# Altium project BGA_Demo_Project.PrjPcb
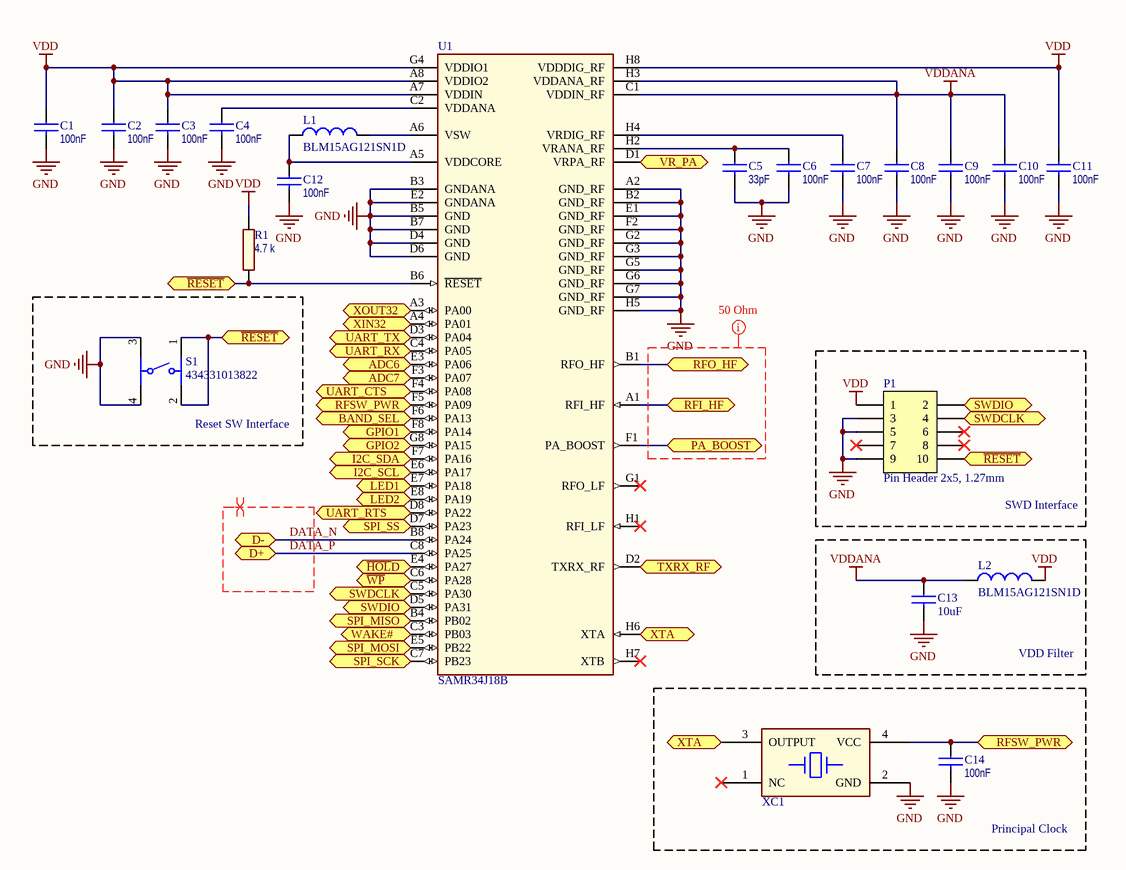
[diagram p0: BGA_Demo_Sch.SchDoc]
1 sheet, 21 parts. Net scope: flat (ports and power ports of the same name join across sheets).
Board file: PCB_BGA_Demo.PcbDoc

## Sheet BGA_Demo_Sch.SchDoc: BGA Demo Project
size A4; Author: Jorge de Castro; CompanyName: PCB Zero; DrawnBy: Jorge de Castro; Engineer: Jorge de Castro; Organization: PCB Zero; Address1: Universo 3; Address2: Valladolid; Address3: 47011; Address4: Spain; DocumentNumber: 1; Revision: 1; SheetNumber: 1; SheetTotal: 1

### Parts
C1  value 100nF  [AP1-00032]  (hidden comment: CAP-NONPOL)
C2  value 100nF  [AP1-00032]  (hidden comment: CAP-NONPOL)
C3  value 100nF  [AP1-00032]  (hidden comment: CAP-NONPOL)
C4  value 100nF  [AP1-00032]  (hidden comment: CAP-NONPOL)
C5  value 33pF  [AP1-00032]  (hidden comment: CAP-NONPOL)
C6  value 100nF  [AP1-00032]  (hidden comment: CAP-NONPOL)
C7  value 100nF  [AP1-00032]  (hidden comment: CAP-NONPOL)
C8  value 100nF  [AP1-00032]  (hidden comment: CAP-NONPOL)
C9  value 100nF  [AP1-00032]  (hidden comment: CAP-NONPOL)
C10  value 100nF  [AP1-00032]  (hidden comment: CAP-NONPOL)
C11  value 100nF  [AP1-00032]  (hidden comment: CAP-NONPOL)
C12  value 100nF  [AP1-00032]  (hidden comment: CAP-NONPOL)
C13  value 10uF  [AP1-00101]  (hidden comment: CAP-NONPOL)
C14  value 100nF  [AP1-00032]  (hidden comment: CAP-NONPOL)
L1  value BLM15AG121SN1D  [INDC1005X04L]  (hidden comment: [APPSSHA])
L2  value BLM15AG121SN1D  [INDC1005X04L]  (hidden comment: [APPSSHA])
P1  Pin Header 2x5, 1.27mm  [HDR_2x5-SMD-1.27mm-K]
R1  value 4.7 k  [RESC1005X04L]  (hidden comment: Chip Resistor 10 kOhm 5% 1/20 W 0201)
S1  434331013822  [4343x10138xx]
U1  value SAMR34J18B  [AP6-00509]  (hidden comment: ATSAMR34 BGA-64)
XC1  ACT33T-4 TCXO  [AP7-00106]  (value not drawn)

### Blocks framed on the sheet
Reset SW Interface: S1
SWD Interface: P1
VDD Filter: C13 L2
Principal Clock: C14 XC1

### Ports
ADC6 (bidir), ADC7 (bidir), BAND_SEL (bidir), D+ (bidir), D- (bidir), GPIO1 (bidir), GPIO2 (bidir), I2C_SCL (bidir), I2C_SDA (bidir), LED1 (bidir), LED2 (bidir), PA_BOOST (bidir), RFI_HF (bidir), RFO_HF (bidir), RFSW_PWR (bidir), SPI_MISO (bidir), SPI_MOSI (bidir), SPI_SCK (bidir), SPI_SS (bidir), SWDCLK (bidir), SWDIO (bidir), TXRX_RF (bidir), UART_CTS (bidir), UART_RTS (bidir), UART_RX (bidir), UART_TX (bidir), VR_PA (bidir), WAKE# (bidir), XIN32 (bidir), XOUT32 (bidir), XTA (bidir), ~{HOL}D (bidir), ~{RESET} (bidir), ~{WP} (bidir)

### Nets
GND: C1.2 C2.2 C3.2 C4.2 C5.2 C6.2 C7.2 C8.2 C9.2 C10.2 C11.2 C12.2 C13.2 C14.2 P1.3 P1.5 P1.9 S1.3 S1.4 U1.A2(GND_RF) U1.B2(GND_RF) U1.B3(GNDANA) U1.B5(GND) U1.B7(GND) U1.D4(GND) U1.D6(GND) U1.E1(GND_RF) U1.E2(GNDANA) U1.F2(GND_RF) U1.G2(GND_RF) U1.G3(GND_RF) U1.G5(GND_RF) U1.G6(GND_RF) U1.G7(GND_RF) U1.H5(GND_RF) XC1.2(GND)
VDD: C1.1 C2.1 C3.1 C11.1 L2.2 P1.1 R1.2 U1.A7(VDDIN) U1.A8(VDDIO2) U1.G4(VDDIO1) U1.H8(VDDDIG_RF)
VDDANA: C8.1 C9.1 C10.1 C13.1 L2.1 U1.C1(VDDIN_RF) U1.H3(VDDANA_RF)
DATA_N: U1.B8(PA24) ; port D-
DATA_P: U1.C8(PA25) ; port D+
NetC4_1: C4.1 U1.C2(VDDANA)
NetC5_1: C5.1 C6.1 U1.H2(VRANA_RF)
NetC7_1: C7.1 U1.H4(VRDIG_RF)
NetC12_1: C12.1 L1.1 U1.A5(VDDCORE)
NetC14_1: C14.1 U1.F5(PA09) XC1.4(VCC) ; port RFSW_PWR
NetL1_2: L1.2 U1.A6(VSW)
NetP1_2: P1.2 U1.D5(PA31) ; port SWDIO
NetP1_4: P1.4 U1.C5(PA30) ; port SWDCLK
NetP1_10: P1.10 R1.1 S1.1 S1.2 U1.B6(~{RESET}) ; port ~{RESET}
NetU1_A1: U1.A1(RFI_HF) ; port RFI_HF
NetU1_A3: U1.A3(PA00) ; port XOUT32
NetU1_A4: U1.A4(PA01) ; port XIN32
NetU1_B1: U1.B1(RFO_HF) ; port RFO_HF
NetU1_B4: U1.B4(PB02) ; port SPI_MISO
NetU1_C3: U1.C3(PB03) ; port WAKE#
NetU1_C4: U1.C4(PA05) ; port UART_RX
NetU1_C6: U1.C6(PA28) ; port ~{WP}
NetU1_C7: U1.C7(PB23) ; port SPI_SCK
NetU1_D1: U1.D1(VRPA_RF) ; port VR_PA
NetU1_D2: U1.D2(TXRX_RF) ; port TXRX_RF
NetU1_D3: U1.D3(PA04) ; port UART_TX
NetU1_D7: U1.D7(PA23) ; port SPI_SS
NetU1_D8: U1.D8(PA22) ; port UART_RTS
NetU1_E3: U1.E3(PA06) ; port ADC6
NetU1_E4: U1.E4(PA27) ; port ~{HOL}D
NetU1_E5: U1.E5(PB22) ; port SPI_MOSI
NetU1_E6: U1.E6(PA17) ; port I2C_SCL
NetU1_E7: U1.E7(PA18) ; port LED1
NetU1_E8: U1.E8(PA19) ; port LED2
NetU1_F1: U1.F1(PA_BOOST) ; port PA_BOOST
NetU1_F3: U1.F3(PA07) ; port ADC7
NetU1_F4: U1.F4(PA08) ; port UART_CTS
NetU1_F6: U1.F6(PA13) ; port BAND_SEL
NetU1_F7: U1.F7(PA16) ; port I2C_SDA
NetU1_F8: U1.F8(PA14) ; port GPIO1
NetU1_G8: U1.G8(PA15) ; port GPIO2
NetU1_H6: U1.H6(XTA) XC1.3(OUTPUT) ; port XTA

Not connected (* = marked no-connect by the designer): P1 6* 7* 8*; U1 G1(RFO_LF)* H1(RFI_LF)* H7(XTB)*; XC1 1(NC)*

### Layout directives
differential pair; rule Differential Pairs Routing [Pref Gap = 0.341mm    Min Gap  = 0.127mm    Max Gap  = 0.341mmPref Width = 0.145mm    Min Width  = 0.094mm    Max Width  = 0.184mm]; differential pair class DiffPCI: DATA_N, DATA_P
rule Width Constraint [Pref Impedance = 50,00ohms    Min Impedance = 50,00ohms    Max Impedance = 50,00ohms]; net class 50 Ohms Rf: (no net found under the mark)

### Notes on the sheet
- Size:
- Date:
- A4
- Number:
- Version:
- Sheet
- of
- Engineer:
- Jorge de Castro
- Email:
- jorge.decastro.es@ieee.org <http://jorge.decastro.es@ieee.org>

### Library data of the parts
C1-C12 C14 = CAP-NONPOL_3: Ceramic capacitor, SMD 0201, C0G/NP0, 25V, +/-2%; PartGroup: Capacitors,Ceramic,SMD 0201; Manufacturer: Johanson Technology; MPN: 250R05L330GV4T; AN: A01-0831; TemperatureRange: -55 to +125 deg; ComponentStatus: 'Active (verified)'; Status: Active; Verified by: Lars Helge Mo; Verified date: 2005-12-15; Tolerance: +/-2%; Height: 0.0130000002682209; FootprintStatus: 'Active (Verified)'
C13 = CAP-NONPOL_2: Ceramic capacitor, SMD 0402, X5R, 6.3V, 20%; PartGroup: Capacitors,Ceramic,SMD 0402; Manufacturer: Murata; MPN: GRM155R60J106ME15; AN: A01-0778; Tolerance: +/-20%; TemperatureRange: -55 to 85 Deg.C; ComponentStatus: 'Active (verified)'; Status: Active; Verified by: Lars Helge Mo; Verified date: 2005-12-15; Height: 0.5; FootprintStatus: 'Active (Verified)'
L1 L2 = INDUCTOR: Chip Bead, 120ohm@100Mhz, 0.55A, 0402, Rdc 0.19ohm; PartGroup: Inductors,EMI; Manufacturer: Murata; AN: A03-0216; Tolerance: 25%; TemperatureRange: -55 to +125â„ƒ; ComponentStatus: 'New (not verified)'; Verified date: 2006-01-30; Verified by: Lars Helge Mo; Status: Active; Height: 0.600000023841858; MPN: BLM15AG121SN1D; FootprintStatus: 'Active (Verified)'
P1 = Pin Header 2x5 SMD, 1.27mm, KS: Pin Header 2x5, 1.27mm (50mil), SMD, Keying Shroud; Manufacturer: W-CON; Manufacturer Part Number: 3132-10MS0BK00R1; 2nd source part number: FTSH-105-01-F-DV-K; Artikkelnr Noca: 55010009; Artikkelnr Simpro: N.A.; Part Number: Pin Header 2x5 SMD, 1.27mm, KS; Datasheet: \\hizz\pro\app9717\Datasheet\connectores\W-CON\3132-XXMXXBK00XX.pdf; Footprint Doc: HDR_2x5-SMD-1.27mm; LatestRevisionDate: 2016-04-21; Pin Count: 10; Publisher: Nordic Semiconductor; Published: 2016-01-22; Value: Pin Header 2x5, 1.27mm; Note: *; Supplier: Cabcon; Supplier part number: 3132-10MS0BK00R1; 2nd source Supplier: Samtec
R1 = R2_2: Thick film resistor, SMD 0201, 1/20W, 5%; PartGroup: Resistors,SMD,0201 5%; Manufacturer: ROHM; MPN: MCR006YZPJ472; AN: A02-0536; ComponentStatus: 'Active (verified)'; Status: Active; Verified by: Lars Helge Mo; Verified date: 2005-12-19; TemperatureRange: 5%; FootprintStatus: 'Active (Verified)'
S1 = 434331013822: WS-TASU SMT Tact Switch 3.5x2.9mm side push; Operation Force: 220g; Rated Voltage: 12VDC; Rated Current: 50mA; Washable: No; ComponentLink1Description: Manufacturer; ComponentLink1URL: http://www.we-online.de; ComponentLink2Description: Datasheet; ComponentLink2URL: https://katalog.we-online.com/em/datasheet/434331013822.pdf; Operating Temperature: -40 to +85degC; Part Number: 434331013822; Published Date: September 2019; Contact Material: Stainless Steel; Height: 1.35mm; Mounting Technology: SMT; Contact Plating: Silver; Packaging: Tape and Reel; Terminal Material: Copper Alloy; Publisher: Wurth Elektronik; Terminal Plating: Silver
U1 = ATSAMR34 BGA-64: SAMR34 BGA-64; PartGroup: Integrated Circuits; AN: A06-1593; ComponentStatus: 'New (not verified)'; Height: 1.20000004768372; FootprintStatus: 'New (Not verified)'
XC1 = ACT33T-4 TCXO: 32MHz TCXO, 2.8 ~ 3.3V, Clipped sine wave 10kOhm/10pF, 2 x 1.6 mm SMD; PartGroup: Frequency devices,Oscillators; Manufacturer: Taitien Electronics; MPN: TYETBCSANF-32.000000; AN: A07-0161; Tolerance: +/-1ppm; TemperatureRange: -20  to  +70Â°C; ComponentStatus: 'New (not verified)'; Value: 32MHz TCXO; Height: 0.800000011920929